# Altium schematic sheet FPGA_POWER_AND_CONFIGURATION.SchDoc: FPGA Configuration
size B; Engineer: M. Jones; Organization: Michael Jones; DocumentNumber: 3; SheetNumber: 3; SheetTotal: 7
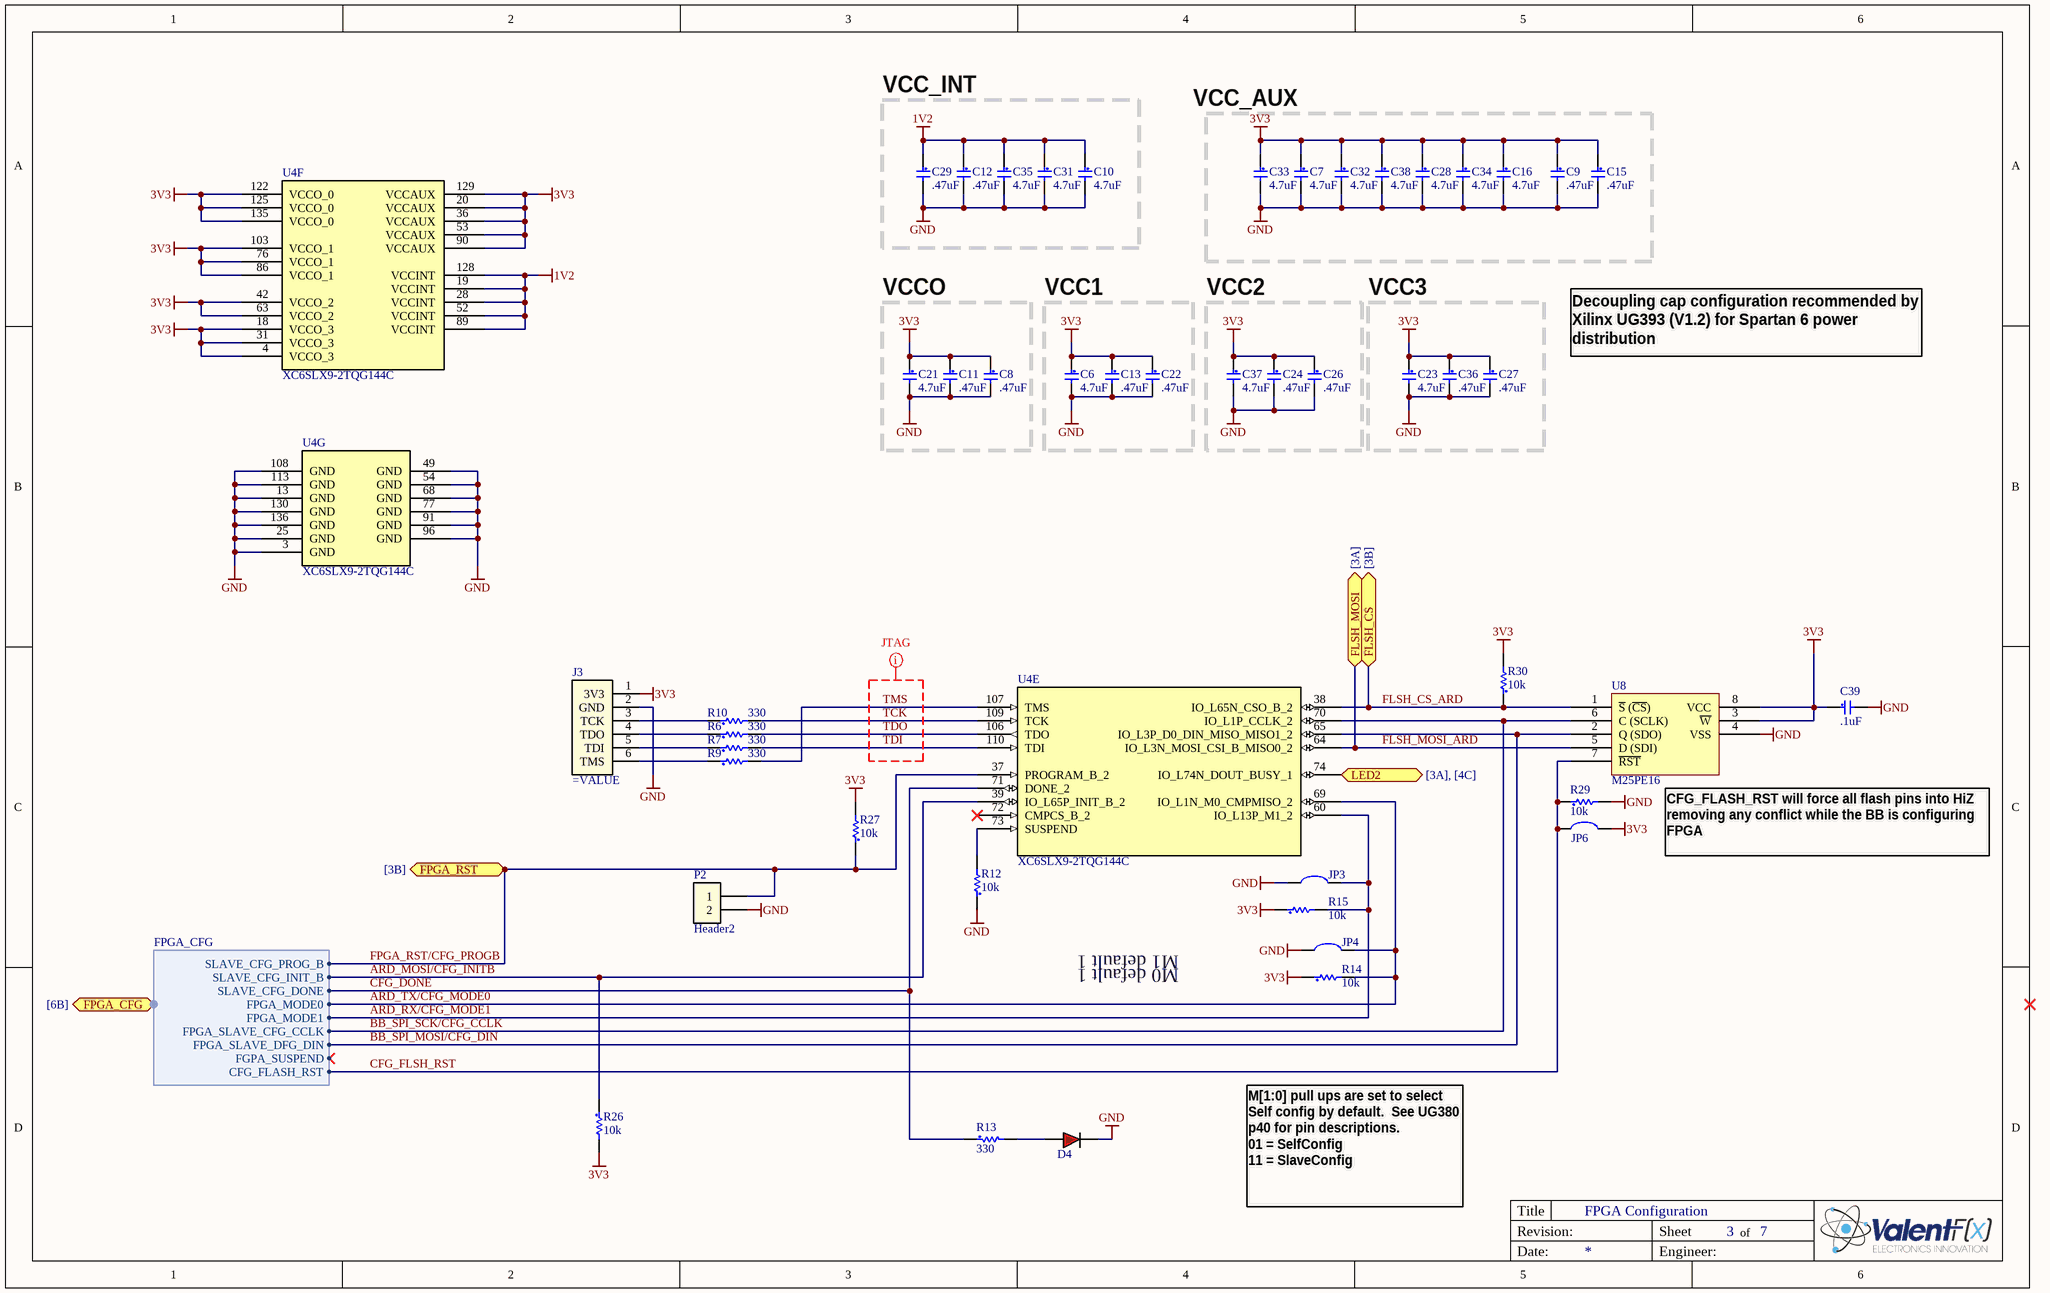
[diagram p0: FPGA_POWER_AND_CONFIGURATION.SchDoc]

## Parts
C6  4.7uF  [C0603 - Marked]
C7  4.7uF  [C0603 - Marked]
C8  .47uF  [C0603]
C9  .47uF  [C0603]
C10  4.7uF  [C0603 - Marked]
C11  .47uF  [C0603]
C12  .47uF  [C0603]
C13  .47uF  [C0603]
C15  .47uF  [C0603]
C16  4.7uF  [C0603 - Marked]
C21  4.7uF  [C0603 - Marked]
C22  .47uF  [C0603]
C23  4.7uF  [C0603 - Marked]
C24  .47uF  [C0603]
C26  .47uF  [C0603]
C27  .47uF  [C0603]
C28  4.7uF  [C0603 - Marked]
C29  .47uF  [C0603]
C31  4.7uF  [C0603 - Marked]
C32  4.7uF  [C0603 - Marked]
C33  4.7uF  [C0603 - Marked]
C34  4.7uF  [C0603 - Marked]
C35  4.7uF  [C0603 - Marked]
C36  .47uF  [C0603]
C37  4.7uF  [C0603 - Marked]
C38  4.7uF  [C0603 - Marked]
C39  .1uF  [c0603]
D4  598-8010-107F  [LED_0603 - RED]  (value not drawn)
J3  (no value)  [JTAG - Digilent HS1 RA]  (no BOM)
JP3  Solder Jumper  [SOLDER_JUMPER]  (value not drawn)  (no BOM)
JP4  Solder Jumper  [SOLDER_JUMPER]  (value not drawn)  (no BOM)
JP6  Solder Jumper  [SOLDER_JUMPER]  (value not drawn)  (no BOM)
P2  Header2  [HEADER_2_40_100 THRU SIP]  (no BOM)
R6  330  [R0603]
R7  330  [R0603]
R9  330  [R0603]
R10  330  [R0603]
R12  10k  [R0603]
R13  330  [R0603]
R14  10k  [R0603]
R15  10k  [R0603]
R26  10k  [R0603]
R27  10k  [R0603]
R29  10k  [R0603]
R30  10k  [R0603]
U4  XC6SLX9-2TQG144C  [TQ144_L]  (parts E,F,G of 7)
U8  M25PE16  [SOIC127P830X200-8L]

## Blocks framed on the sheet
VCC_INT: C10 C12 C29 C31 C35
VCCO: C8 C11 C21
VCC1: C6 C13 C22
VCC2: C24 C26 C37
VCC3: C23 C27 C36

## Ports
FLSH_CS (see [3B]), FLSH_MOSI (see [3A]), FPGA_CFG (harness FPGA_CFG, see [6B]), FPGA_RST (see [3B]), LED2 (see [3A], [4C])

## Harnesses
FPGA_CFG: SLAVE_CFG_PROG_B, SLAVE_CFG_INIT_B, SLAVE_CFG_DONE, FPGA_MODE0, FPGA_MODE1, FPGA_SLAVE_CFG_CCLK, FPGA_SLAVE_DFG_DIN, FGPA_SUSPEND, CFG_FLASH_RST

## Nets
1V2: C10.1 C12.1 C29.1 C31.1 C35.1 U4.19(VCCINT) U4.28(VCCINT) U4.52(VCCINT) U4.89(VCCINT) U4.128(VCCINT)
3V3: C6.1 C7.1 C8.1 C9.1 C11.1 C13.1 C15.1 C16.1 C21.1 C22.1 C23.1 C24.1 C26.1 C27.1 C28.1 C32.1 C33.1 C34.1 C36.1 C37.1 C38.1 C39.1 J3.1(3V3) JP6.1 R14.1 R15.1 R26.2 R27.2 R30.2 U4.4(VCCO_3) U4.18(VCCO_3) U4.20(VCCAUX) U4.31(VCCO_3) U4.36(VCCAUX) U4.42(VCCO_2) U4.53(VCCAUX) U4.63(VCCO_2) U4.76(VCCO_1) U4.86(VCCO_1) U4.90(VCCAUX) U4.103(VCCO_1) U4.122(VCCO_0) U4.125(VCCO_0) U4.129(VCCAUX) U4.135(VCCO_0) U8.3(~{W}) U8.8(VCC)
GND: C6.2 C7.2 C8.2 C9.2 C10.2 C11.2 C12.2 C13.2 C15.2 C16.2 C21.2 C22.2 C23.2 C24.2 C26.2 C27.2 C28.2 C29.2 C31.2 C32.2 C33.2 C34.2 C35.2 C36.2 C37.2 C38.2 C39.2 D4.C J3.2(GND) JP3.2 JP4.2 P2.2 R12.1 R29.2 U4.3(GND) U4.13(GND) U4.25(GND) U4.49(GND) U4.54(GND) U4.68(GND) U4.77(GND) U4.91(GND) U4.96(GND) U4.108(GND) U4.113(GND) U4.130(GND) U4.136(GND) U8.4(VSS)
ARD_MOSI/CFG_INITB: R26.1 U4.39(IO_L65P_INIT_B_2) ; port FPGA_CFG.SLAVE_CFG_INIT_B
ARD_RX/CFG_MODE1: JP3.1 R15.2 U4.60(IO_L13P_M1_2) ; port FPGA_CFG.FPGA_MODE1
ARD_TX/CFG_MODE0: JP4.1 R14.2 U4.69(IO_L1N_M0_CMPMISO_2) ; port FPGA_CFG.FPGA_MODE0
BB_SPI_MOSI/CFG_DIN: U4.65(IO_L3P_D0_DIN_MISO_MISO1_2) U8.2(Q_(SDO)) ; port FPGA_CFG.FPGA_SLAVE_DFG_DIN
BB_SPI_SCK/CFG_CCLK: U4.70(IO_L1P_CCLK_2) U8.6(C_(SCLK)) ; port FPGA_CFG.FPGA_SLAVE_CFG_CCLK
CFG_DONE: R13.1 U4.71(DONE_2) ; port FPGA_CFG.SLAVE_CFG_DONE
CFG_FLSH_RST: JP6.2 R29.1 U8.7(~{RST}) ; port FPGA_CFG.CFG_FLASH_RST
FLSH_CS_ARD: R30.1 U4.38(IO_L65N_CSO_B_2) U8.1(~{S}_(~{CS})) ; port FLSH_CS
FLSH_MOSI_ARD: U4.64(IO_L3N_MOSI_CSI_B_MISO0_2) U8.5(D_(SDI)) ; port FLSH_MOSI
FPGA_RST/CFG_PROGB: P2.1 R27.1 U4.37(PROGRAM_B_2) ; port FPGA_RST, port FPGA_CFG.SLAVE_CFG_PROG_B
LED2: U4.74(IO_L74N_DOUT_BUSY_1) ; port LED2
TCK: R10.2 U4.109(TCK)
TDI: R7.2 U4.110(TDI)
TDO: R6.2 U4.106(TDO)
TMS: R9.2 U4.107(TMS)
NetD4_A: D4.A R13.2
NetJ3_3: J3.3(TCK) R10.1
NetJ3_4: J3.4(TDO) R6.1
NetJ3_5: J3.5(TDI) R7.1
NetJ3_6: J3.6(TMS) R9.1
NetR12_2: R12.2 U4.73(SUSPEND)

Not connected (* = marked no-connect by the designer): U4 72(CMPCS_B_2)*

## Layout directives
net class JTAG: TCK, TDI, TDO, TMS

## Notes on the sheet
- VCC_AUX
- Decoupling cap configuration recommended by Xilinx UG393 (V1.2) for Spartan 6 power distribution
- (near U8) CFG_FLASH_RST will force all flash pins into HiZ removing any conflict while the BB is configuring FPGA
- M0 default 1
- M1 default 1
- M[1:0] pull ups are set to select Self config by default.  See UG380 p40 for pin descriptions.
  01 = SelfConfig
  11 = SlaveConfig
- Title
- Revision:
- Sheet
- of
- Date:
- Engineer:

## Library data of the parts
C6 C7 C10 C16 C21 C23 C28 C31-C35 C37 C38 = C0603 - GRM188R60J475KE19D: 4.7uF 6.3volts X5R 10% (MLCC) - SMD/SMT 0603; Manufacturer: Murata Electronics North America; Accept Compatible Replacement Part: Yes; Capacitance: 4.7µF; Voltage - Rated: 6.3V; Supplier 1: Digi-Key; Manufacturer Part Number: GRM188R60J475KE19D; RoHS: RoHS Compliant; Category: Capacitors; Stock 1: 614848; Pricing 1: 1=0.19, 10=0.132, 50=0.076, 100=0.0627, 250=0.05284, 500=0.04426, 1000=0.03633 (USD); Tolerance: ±10%; Package / Case: 0603 (1608 Metric); Packaging: Cut Tape (CT); ComponentLink1URL: http://search.murata.co.jp/Ceramy/image/img/PDF/ENG/GRM188R60J475KE19.pdf; ComponentLink1Description: http://search.murata.co.jp/Ceramy/image/img/PDF/ENG/GRM188R60J475KE19.pdf; Value: 4.7uF; Temperature Coefficient: X5R; Mounting Type: Surface Mount, MLCC; Operating Temperature: -55°C ~ 85°C; Applications: General Purpose; Ratings: -; Size / Dimension: 0.063" L x 0.031" W (1.60mm x 0.80mm); Height - Seated (Max): -; Thickness (Max): 0.035" (0.90mm); Lead Spacing: -; Features: -; Lead Style: -; Supplier Part Number 1: 490-3297-1-ND
C8 C9 C11-C13 C15 C22 C24 C26 C27 C29 C36 = C0603 - GCM188R71E474KA64D: .47uF 25VDC X7R 10% SMD 0603 Paper T/R CERAMIC; Manufacturer: Murata Electronics North America; Accept Compatible Replacement Part: Yes; Capacitance: 0.47µF; Voltage - Rated: 25V; Supplier 1: Digi-Key; Supplier Part Number 1: 490-4776-1-ND; Manufacturer Part Number: GCM188R71E474KA64D; RoHS: RoHS Compliant; Stock 1: 100000; Pricing 1: 1=0.26, 10=0.214, 50=0.1202, 100=0.1068, 250=0.08012, 500=0.07076, 1000=0.06275 (USD); ComponentLink1URL: http://search.murata.co.jp/Ceramy/image/img/PDF/ENG/GCM188R71E474KA64.pdf; ComponentLink1Description: http://search.murata.co.jp/Ceramy/image/img/PDF/ENG/GCM188R71E474KA64.pdf; Value: .47uF; Category: Capacitors; Tolerance: ±10%; Temperature Coefficient: X7R; Mounting Type: Surface Mount, MLCC; Operating Temperature: -55°C ~ 125°C; Applications: Automotive; Ratings: AEC-Q200; Package / Case: 0603 (1608 Metric); Size / Dimension: 0.063" L x 0.031" W (1.60mm x 0.80mm); Height - Seated (Max): -; Thickness (Max): 0.035" (0.90mm); Lead Spacing: -; Features: -; Packaging: Cut Tape (CT); Lead Style: -
C39 = C0603 - CL10F104ZA8NNNC: CAP CER 0.1UF 25V Y5V 0603; Manufacturer: Samsung Electro-Mechanics America, Inc; Capacitance: 0.1µF; Tolerance: -20%, +80%; Temperature Coefficient: Y5V (F); Accept Alternative: Yes; Supplier 1: Digi-Key; Manufacturer Part Number: CL10F104ZA8NNNC; RoHS: RoHS Compliant; Category: Capacitors; Stock 1: 400907; Pricing 1: 1=0.1, 10=0.017, 25=0.012, 50=0.009, 100=0.0076, 250=0.00624, 500=0.00536, 1000=0.00417 (USD); Package / Case: 0603 (1608 Metric); Packaging: Cut Tape (CT); ComponentLink1URL: http://www.samsungsem.com/servlet/FileDownload?type=spec&file=CL10F104ZA8NNNC.pdf; ComponentLink1Description: http://www.samsungsem.com/servlet/FileDownload?type=spec&file=CL10F104ZA8NNNC.pdf; Supplier Part Number 1: 1276-1011-1-ND; Value: .1uF; Voltage - Rated: 25V; Mounting Type: Surface Mount, MLCC; Operating Temperature: -30°C ~ 85°C; Applications: General Purpose; Ratings: -; Size / Dimension: 0.063" L x 0.031" W (1.60mm x 0.80mm); Height - Seated (Max): -; Thickness (Max): 0.035" (0.90mm); Lead Spacing: -; Features: -; Lead Style: -; Accept Compatible Replacement Part: Yes
D4 = LED0603 - 598-8010-107F: LED ALINGAP RED CLEAR 0603 SMD; Manufacturer: Dialight; Current - Test: 20mA; Wavelength - Dominant: 635nm; Millicandela Rating: 40mcd; Voltage - Forward (Vf) Typ: 2.2V; Lens Style/Size: Rectangle with Flat Top, 1.1mm x 0.8mm; Viewing Angle: 140°; Accept Replacement: YES - Water Clear; Supplier 1: Digi-Key; Supplier Part Number 1: 350-2029-6-ND; Manufacturer Part Number: 598-8010-107F; RoHS: RoHS Compliant; Category: Optoelectronics; Stock 1: 37578; Pricing 1: 1=0.45, 10=0.33, 25=0.264, 100=0.1749, 250=0.1452, 500=0.1056, 1000=0.0825 (USD); Color: Red; Luminous Flux @ Current - Test: -; Wavelength - Peak: -; Lens Type: Clear; Size / Dimension: 1.60mm L x 0.80mm W; Height: 0.70mm; Package / Case: 0603 (1608 Metric); Mounting Type: Surface Mount; Packaging: Digi-Reel®; ComponentLink1URL: http://media.digikey.com/pdf/Data%20Sheets/Dialight%20PDFs/598_Series_0603_Pkg.pdf; ComponentLink1Description: http://media.digikey.com/pdf/Data%20Sheets/Dialight%20PDFs/598_Series_0603_Pkg.pdf
J3 = JTAG - Digilent HS1: DIGILENT - 410-205 - PROGRAMMING CABLE, JTAG HS1, USB2; Manufacturer: Samtec; Manufacturer Part Number: TSW-106-08-G-S-RA; Lead Time: 0 weeks; Peak Solder Temperature: 260 deg C; MSL Level Min: N/R; Connector Type: Header, Unshrouded; Number of Positions: 6; Number of Positions Loaded: All; Pitch: 0.100" (2.54mm); Supplier 1: Arrow; RoHS: CHINA ROHS: Compliant / EU ROHS: Compliant; Stock 1: 0; Pricing 1: 0=0.2649 (USD); ComponentLink1URL: http://components.arrow.com/partservice/dataview/altium/2677508S3639200N1004?apiKey=aa438727d59eed98c4bed826d8d949c84cb5e685b92bf87346a0226bd2658797; ComponentLink1Description: http://components.arrow.com/partservice/dataview/altium/2677508S3639200N1004?apiKey=aa438727d59eed98c4bed826d8d949c84cb5e685b92bf87346a0226bd2658797; Supplier Part Number 1: 2677508S3639200N1004; Package Quantity: 1; Termination Finish: Au/Ni; MSL Level Max: N/R; MSL (Moisture Sensitivity Level): N/R; China ROHS Lead (X -> above / O -> below threshold): O; China ROHS Mercury (X -> above / O -> below threshold): O; China ROHS Cadmium (X -> above / O -> below threshold): O; China ROHS Hex Chromium (X -> above / O -> below threshold): O; China ROHS PBB (X -> above / O -> below threshold): O; China ROHS PBDE (X -> above / O -> below threshold): O; EU_ROHS_PROD_EXEMPTION_BY_SUPP: N/R; Supplier 2: Digi-Key; Category: Connectors, Interconnects; Stock 2: 0; Pricing 2: 1=0.94, 10=0.841, 100=0.6926, 500=0.5475, 1000=0.46999, 5000=0.42877, 10000=0.41228 (USD); Contact Type: Male Pin; Number of Rows: 1; Row Spacing: -; Contact Mating Length: 0.230" (5.84mm); Mounting Type: Through Hole; Termination: Solder; Fastening Type: -; Features: -; Contact Finish: Gold; Contact Finish Thickness: 10µin (0.25µm); Color: Black; Packaging: Bulk; ComponentLink2URL: http://www.samtec.com/documents/webfiles/cpdf/TSW-XXX-XX-XXX-X-XX-XXX-MKT.pdf; ComponentLink2Description: http://www.samtec.com/documents/webfiles/cpdf/TSW-XXX-XX-XXX-X-XX-XXX-MKT.pdf; Supplier Part Number 2: SAM1038-06-ND
JP3 JP4 JP6 = Solder Jumper: Solder/Configuration Jumper; Manufacturer: n/a; Manufacturer Part Number: n/a; Source: n/a; Source Part Number: n/a; ROHS Certificate: n/a
P2 = Header2: Header 2 pin
R6 R7 R9 R10 = R0603 - ERJ-3GEYJ331V: Thick Film Resistors - SMD 0603 330ohms 5% Tol; Manufacturer: Panasonic; Power Rating: 100 mW; Temperature Coefficient: 200 PPM / C; Voltage Rating: 75 V; Supplier 1: Mouser; Manufacturer Part Number: ERJ-3GEYJ331V; RoHS: RoHS Compliant By Exemption; Category: Thick Film Resistors - SMD; Stock 1: 131470; Pricing 1: 1=0.108, 10=0.012, 100=0.005, 1000=0.004, 5000=0.003 (AUD); Dimensions: 0.8 mm W x 1.6 mm L x 0.45 mm H; Operating Temperature Range: - 55 C to + 155 C; Package / Case: 0603 (1608 metric); Packaging: Reel; Product: Thick Film Resistors SMD; Resistance: 330 Ohms; Series: ERJ; Termination Style: SMD/SMT; Tolerance: 5 %; Standard Pack Qty: 5000; RoHS - Mouser: E; Minimum Order Quantity: 1; Reeling: True; ComponentLink1URL: http://www.mouser.com/ds/2/315/AOA0000CE1-37422.pdf; ComponentLink1Description: http://www.mouser.com/ds/2/315/AOA0000CE1-37422.pdf; Supplier Part Number 1: 667-ERJ-3GEYJ331V; Value: 330; Case Code - in: 0603; Case Code - mm: 1608
R12 R14 R15 R26 R27 R29 R30 = R0603 - CRCW060310K0FKEA: 10k Thick Film Resistors - SMD 1/10watt 10Kohms 1%; Manufacturer: Vishay Dale; Power (Watts): 0.1W, 1/10W; Temperature Coefficient: ±100ppm/°C; Manufacturer Part Number: CRCW060310K0FKEA; Value: 10k; Supplier 1: Digi-Key; RoHS: RoHS Compliant; Category: Resistors; Stock 1: 997856; Pricing 1: 10=0.081, 50=0.0436, 200=0.0251, 1000=0.01711 (USD); Resistance (Ohms): 10K; Composition: Thick Film; Features: -; Tolerance: ±1%; Size / Dimension: 0.061" L x 0.033" W (1.55mm x 0.85mm); Height: 0.020" (0.50mm); Packaging: Cut Tape (CT); Package / Case: 0603 (1608 Metric); ComponentLink1URL: http://www.vishay.com/doc?20035; ComponentLink1Description: http://www.vishay.com/doc?20035; Supplier Part Number 1: 541-10.0KHCT-ND; Number of Terminations: 2
R13 = R0603 - ERJ-3GEYJ331V: Thick Film Resistors - SMD 0603 330ohms 5% Tol; Manufacturer: Panasonic; Temperature Coefficient: 200 PPM / C; Power Rating: 100 mW; Voltage Rating: 75 V; Manufacturer Part Number: ERJ-3GEYJ331V; Value: 330; Supplier 1: Mouser; Supplier Part Number 1: 667-ERJ-3GEYJ331V; RoHS: RoHS Compliant By Exemption; Category: Thick Film Resistors - SMD; Stock 1: 131470; Pricing 1: 1=0.108, 10=0.012, 100=0.005, 1000=0.004, 5000=0.003 (AUD); Tolerance: 5 %; Packaging: Reel; Package / Case: 0603 (1608 metric); ComponentLink1URL: http://www.mouser.com/ds/2/315/AOA0000CE1-37422.pdf; ComponentLink1Description: http://www.mouser.com/ds/2/315/AOA0000CE1-37422.pdf; Dimensions: 0.8 mm W x 1.6 mm L x 0.45 mm H; Operating Temperature Range: - 55 C to + 155 C; Product: Thick Film Resistors SMD; Resistance: 330 Ohms; Series: ERJ; Termination Style: SMD/SMT; Case Code - in: 0603; Case Code - mm: 1608; Standard Pack Qty: 5000; RoHS - Mouser: E; Minimum Order Quantity: 1; Reeling: True
U4 = FPGA - XC6SLX9-2TQG144C: IC FPAG SPARTAN 6 9K 144TQFP; Manufacturer: Xilinx Inc; Number of Logic Elements/Cells: 9152; Number of LABs/CLBs: 715; Total RAM Bits: 589824; Number of I /O: 102; Voltage - Supply: 1.14 V ~ 1.26 V; Supplier 1: America II Electronics; Supplier Part Number 1: 122-1745-ND; Manufacturer Part Number: XC6SLX9-2TQG144C; RoHS: RoHS Compliant; Category: Integrated Circuits (ICs); Stock 1: 994; Pricing 1: 1=12.80,1=11.05,1000=9.59 (USD); Number of Gates: -; Mounting Type: Surface Mount; Operating Temperature: 0°C ~ 85°C; Package / Case: 144-LQFP; Supplier Device Package: 144-TQFP (20x20); ComponentLink1URL: http://www.xilinx.com/support/documentation/data_sheets/ds160.pdf; ComponentLink1Description: http://www.xilinx.com/support/documentation/data_sheets/ds160.pdf; Value: XC6SLX9-2TQG144C; Supplier 2: Digi-Key
U8 = M25PE16-VMW6TG: IC FLASH 16MBIT 75MHZ 8SOIC; Manufacturer: Numonyx/ST Micro; Memory Size: 16M (2M x 8); Interface: SPI, 3-Wire Serial; Voltage - Supply: 2.7 V ~ 3.6 V; Supplier 1: Digi-Key; Manufacturer Part Number: M25PE16-VMW6TG; RoHS: RoHS Compliant; Category: Integrated Circuits (ICs); Stock 1: 866; Pricing 1: 1=2.31, 10=1.98, 25=1.782, 100=1.617, 250=1.452, 500=1.254 (USD); Format - Memory: FLASH; Memory Type: FLASH; Speed: 75MHz; Operating Temperature: -40°C ~ 85°C; Package / Case: 8-SOIC (0.200", 5.30mm Width); Packaging: Cut Tape (CT); Supplier Device Package: *; ComponentLink1URL: http://www.numonyx.com/Documents/Datasheets/M25PE16.pdf; ComponentLink1Description: http://www.numonyx.com/Documents/Datasheets/M25PE16.pdf; Supplier Part Number 1: M25PE16-VMW6TGCT-ND; Value: M25PE16